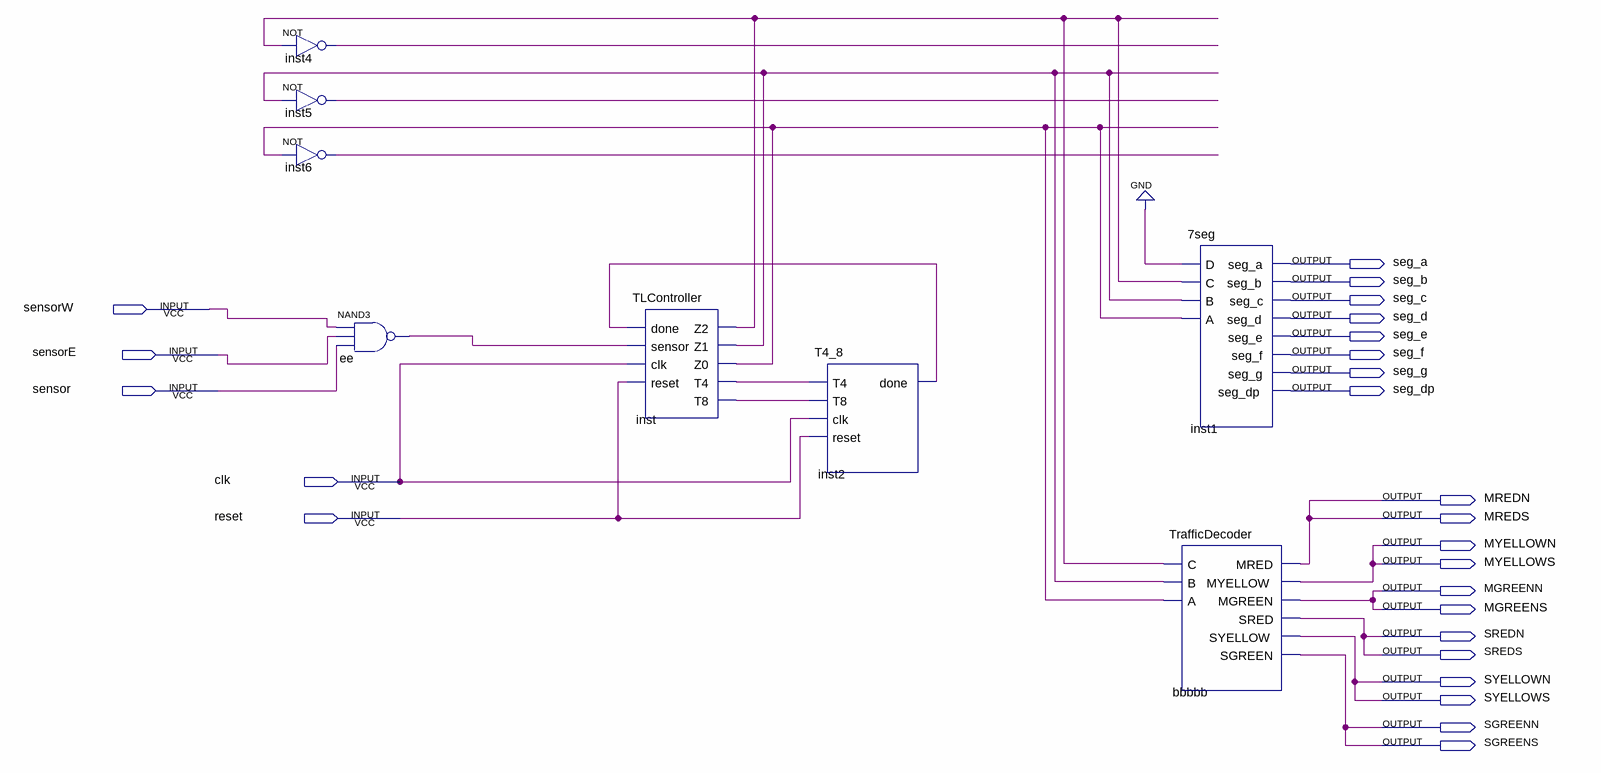
[diagram p0: schematic sheet]
// Quartus schematic TLmaster.bdf as structural Verilog: 8 symbols, 25 pins
module TLmaster (
  input  sensorW,
  input  sensorE,
  input  sensor,
  input  clk,
  input  reset,
  output seg_a,
  output seg_b,
  output seg_c,
  output seg_d,
  output seg_e,
  output seg_f,
  output seg_g,
  output seg_dp,
  output MREDN,
  output MREDS,
  output MYELLOWN,
  output MYELLOWS,
  output MGREENN,
  output MGREENS,
  output SREDN,
  output SREDS,
  output SYELLOWN,
  output SYELLOWS,
  output SGREENN,
  output SGREENS
);

  wire ee_out, inst2_done, inst4_out, inst5_out, inst6_out, inst_t4, inst_t8, inst_z0, inst_z1, inst_z2;

  not inst4 (inst4_out, inst_z2);
  not inst5 (inst5_out, inst_z1);
  not inst6 (inst6_out, inst_z0);
  nand ee (ee_out, sensorW, sensorE, sensor);
  TLController inst (
    .done(inst2_done), .sensor(ee_out), .clk(clk), .reset(reset), .Z2(inst_z2), .Z1(inst_z1), .Z0(inst_z0),
    .T4(inst_t4), .T8(inst_t8));
  T4_8 inst2 (.T4(inst_t4), .T8(inst_t8), .clk(clk), .reset(reset), .done(inst2_done));
  \7seg  inst1 (
    .D(1'b0), .C(inst_z2), .B(inst_z1), .A(inst_z0), .seg_a(seg_a), .seg_b(seg_b), .seg_c(seg_c),
    .seg_d(seg_d), .seg_e(seg_e), .seg_f(seg_f), .seg_g(seg_g), .seg_dp(seg_dp));
  TrafficDecoder bbbbb (
    .C(inst_z2), .B(inst_z1), .A(inst_z0), .MRED(MREDN), .MYELLOW(MYELLOWN), .MGREEN(MGREENN), .SRED(SREDN),
    .SYELLOW(SYELLOWN), .SGREEN(SGREENN));

  assign MGREENS = MGREENN;
  assign MREDS = MREDN;
  assign MYELLOWS = MYELLOWN;
  assign SGREENS = SGREENN;
  assign SREDS = SREDN;
  assign SYELLOWS = SYELLOWN;
endmodule
